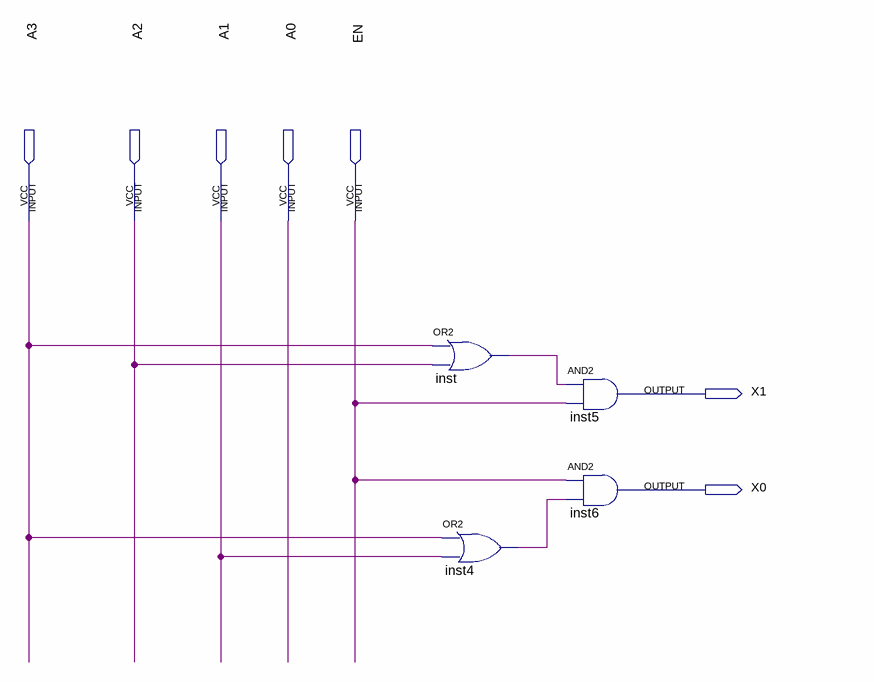
[diagram p0: schematic sheet]
// Quartus schematic Encoder4x2.bdf as structural Verilog: 4 symbols, 7 pins
module Encoder4x2 (
  input  A3,
  input  A2,
  input  A1,
  input  A0,
  input  EN,
  output X1,
  output X0
);

  wire inst4_out, inst_out;

  or inst (inst_out, A3, A2);
  or inst4 (inst4_out, A3, A1);
  and inst5 (X1, inst_out, EN);
  and inst6 (X0, EN, inst4_out);
endmodule
